# Altium schematic sheet DRV_TOP_MOS.SchDoc
size A2; SheetNumber: 3; SheetTotal: 4
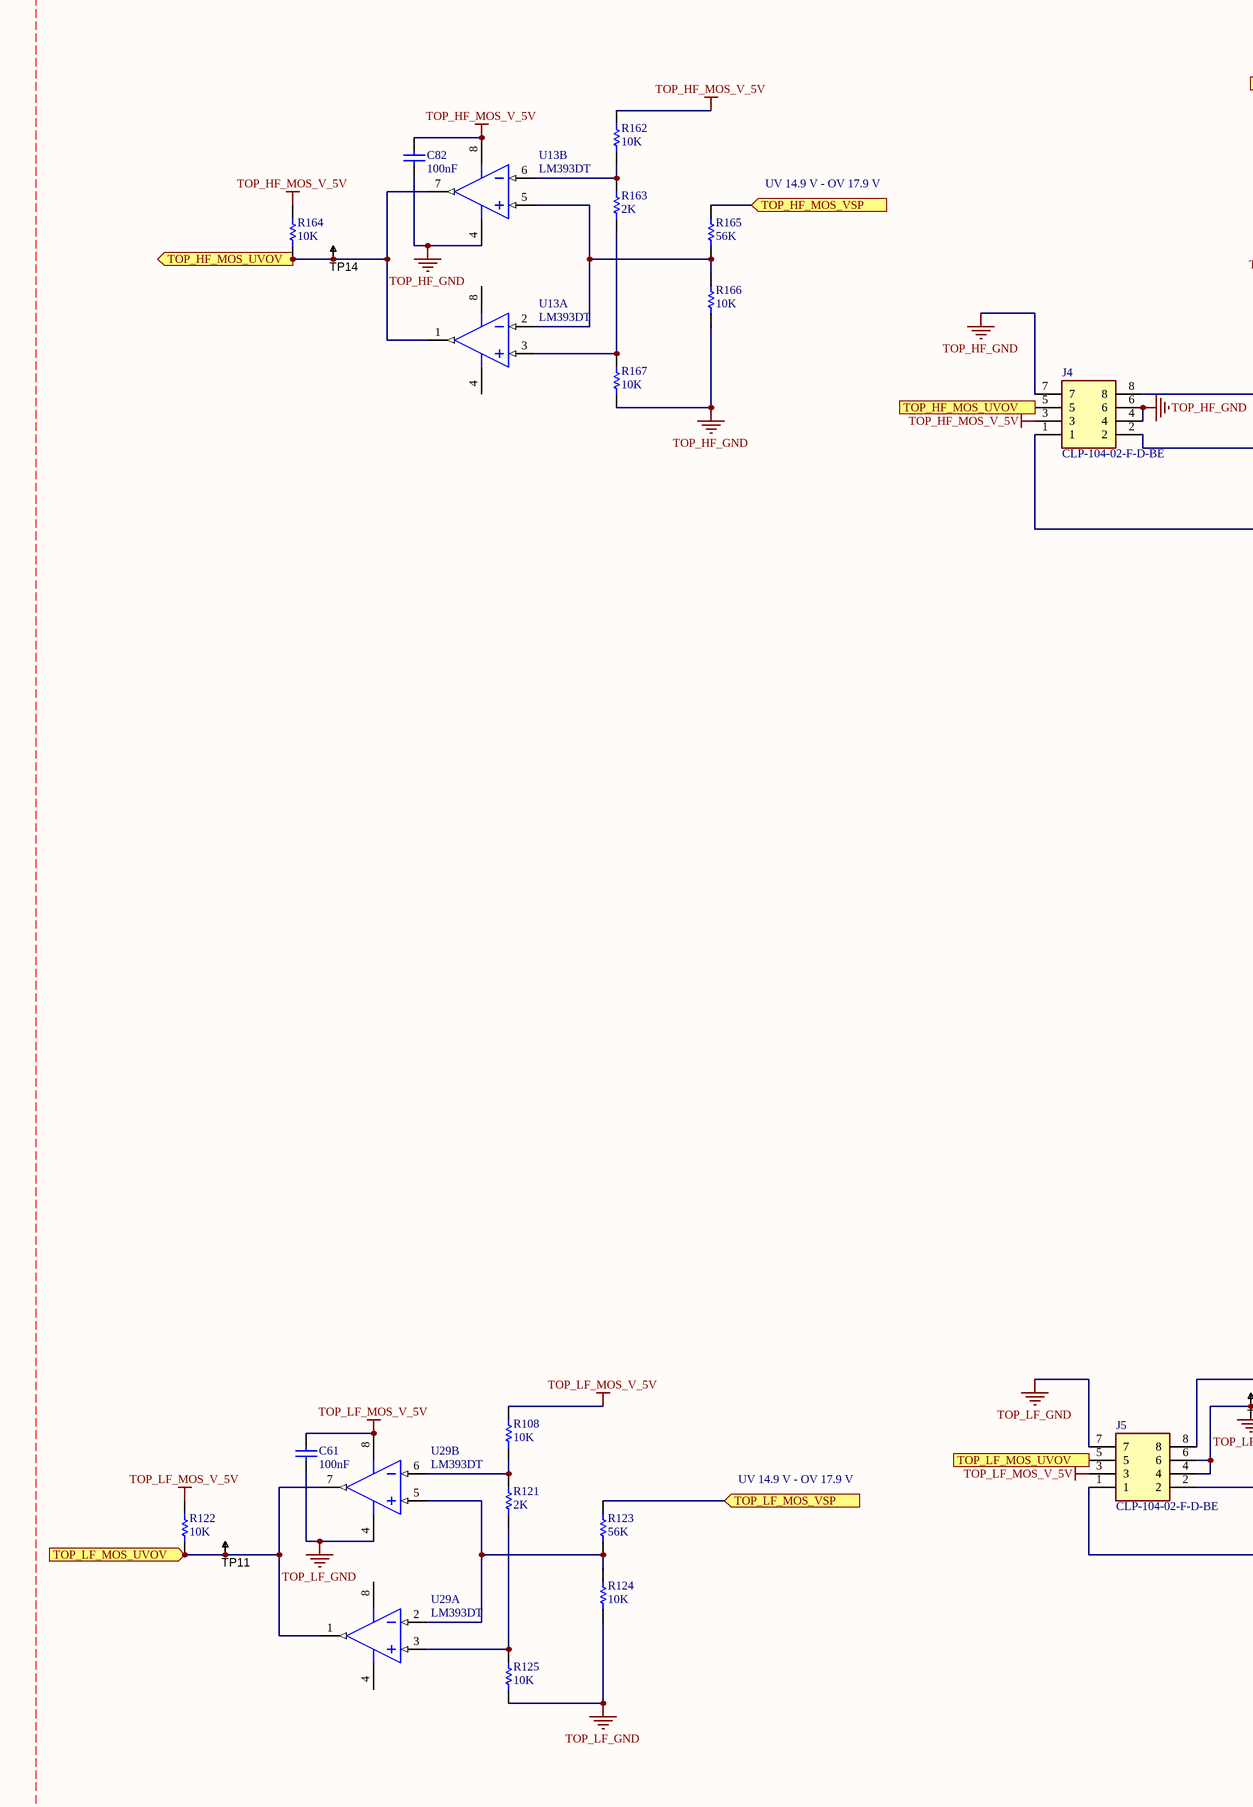
[diagram p0: DRV_TOP_MOS.SchDoc, left]
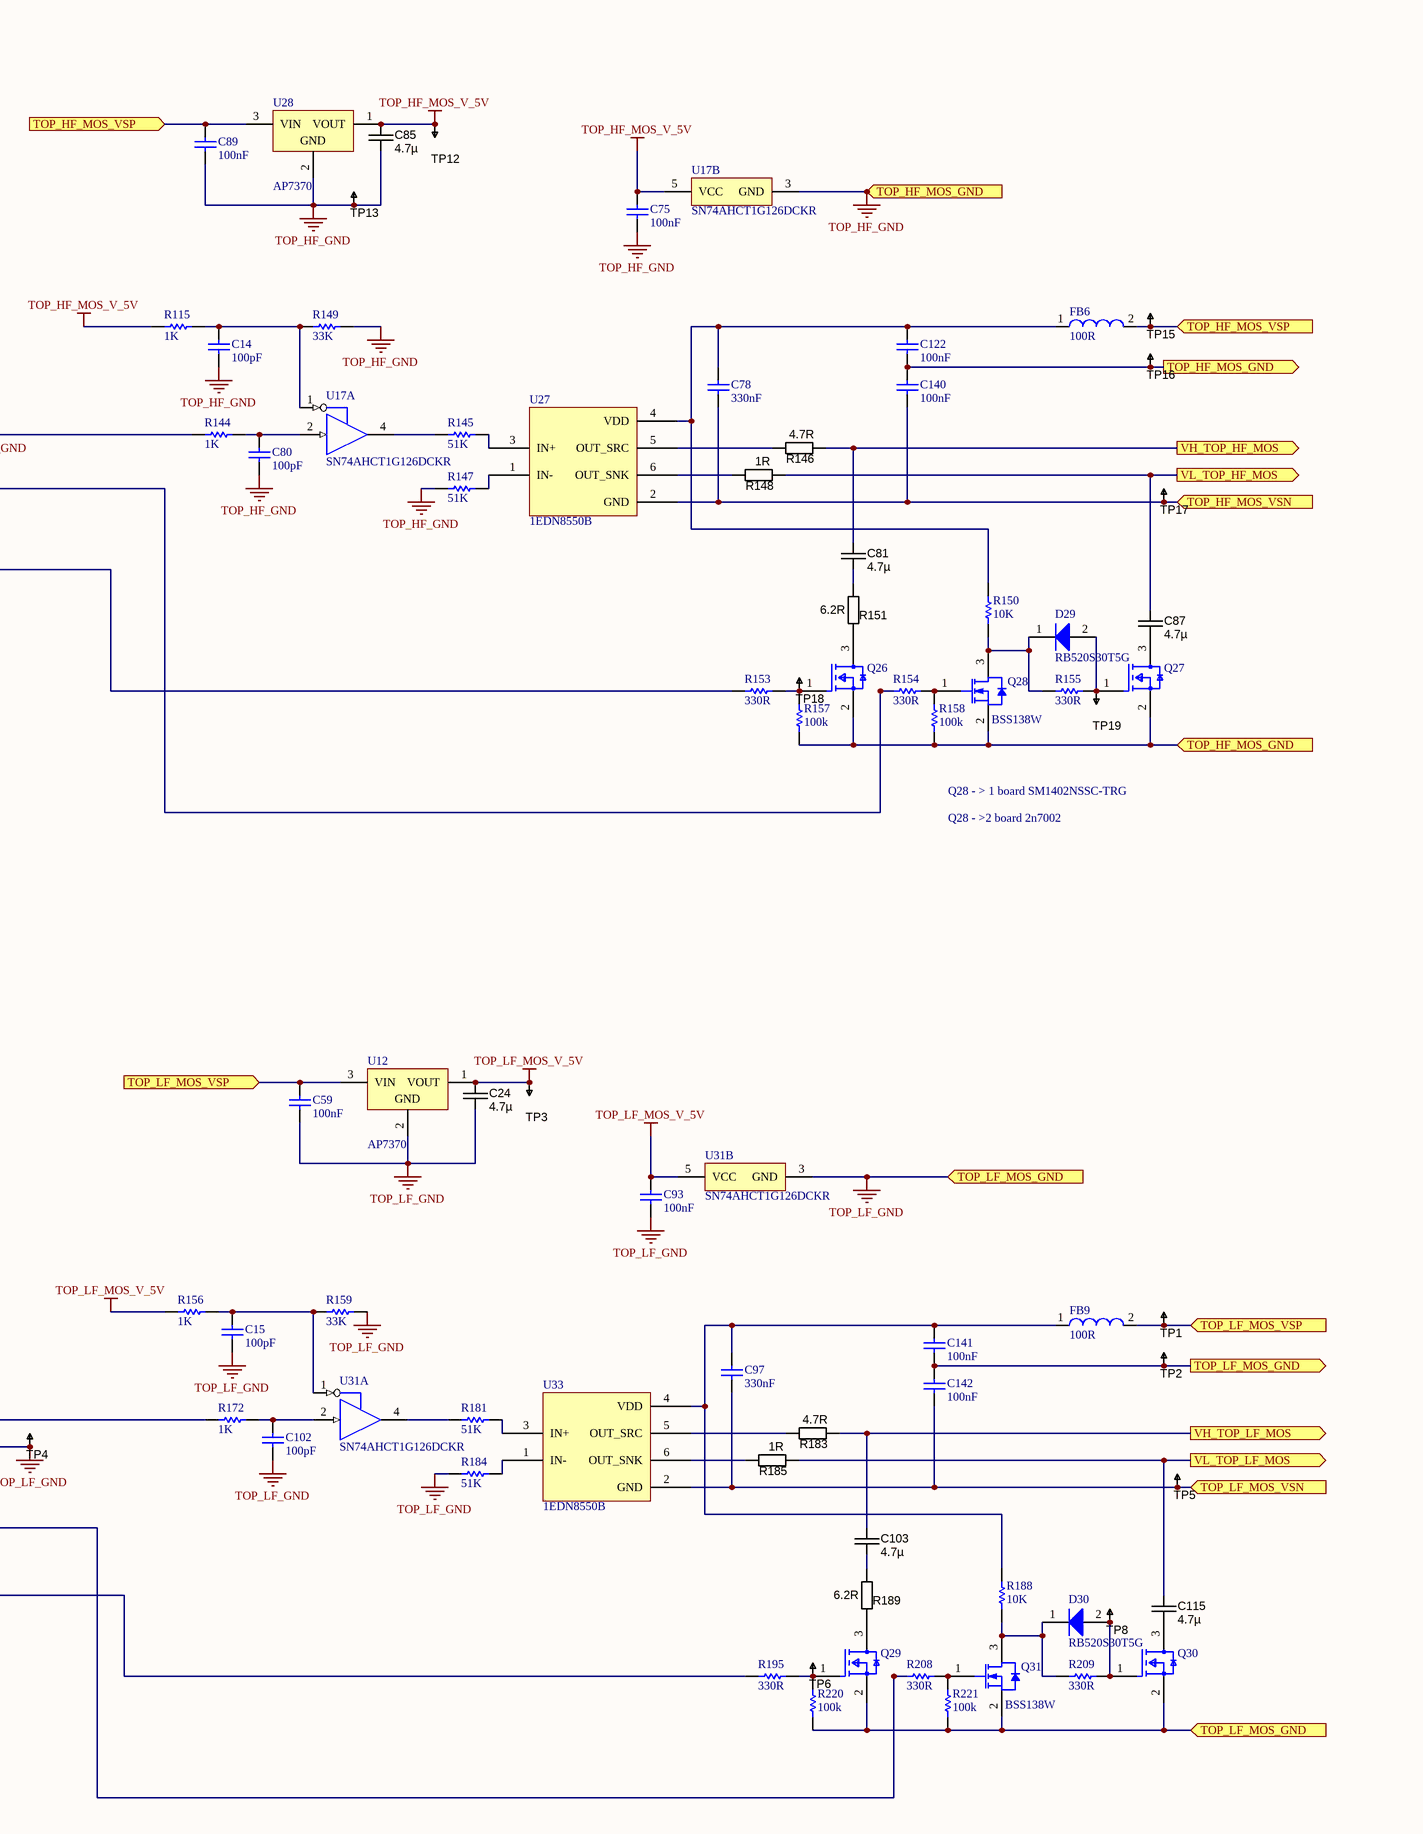
[diagram p1: DRV_TOP_MOS.SchDoc, right]

## Parts
C14  100pF  [CAPC1005X55X25NL05T10]
C15  100pF  [CAPC1005X55X25NL05T10]
C24  value 4.7µ  [CAPC2012X135N]  (hidden comment: 4.7uF)
C59  100nF  [CAPC1608X90X35NL10T15]
C61  100nF  [CAPC1608X90X35NL10T15]
C75  100nF  [CAPC1608X90X35NL10T15]
C78  330nF  [CAPC2013X135X45NL10T25]
C80  100pF  [CAPC1005X55X25NL05T10]
C81  value 4.7µ  [CAPC2012X135N]  (hidden comment: 4.7uF)
C82  100nF  [CAPC1608X90X35NL10T15]
C85  value 4.7µ  [CAPC2012X135N]  (hidden comment: 4.7uF)
C87  value 4.7µ  [CAPC2012X135N]  (hidden comment: 4.7uF)
C89  100nF  [CAPC1608X90X35NL10T15]
C93  100nF  [CAPC1608X90X35NL10T15]
C97  330nF  [CAPC2013X135X45NL10T25]
C102  100pF  [CAPC1005X55X25NL05T10]
C103  value 4.7µ  [CAPC2012X135N]  (hidden comment: 4.7uF)
C115  value 4.7µ  [CAPC2012X135N]  (hidden comment: 4.7uF)
C122  100nF  [CAPC1608X90X35NL10T15]
C140  100nF  [CAPC1608X90X35NL10T15]
C141  100nF  [CAPC1608X90X35NL10T15]
C142  100nF  [CAPC1608X90X35NL10T15]
D29  RB520S30T5G  [ONSC-SOD-523-2-502-01_V]
D30  RB520S30T5G  [ONSC-SOD-523-2-502-01_V]
FB6  100R  [SMD-0603]
FB9  100R  [SMD-0603]
J4  CLP-104-02-F-D-BE  [CLP-104-02-XXX-D-BE]
J5  CLP-104-02-F-D-BE  [CLP-104-02-XXX-D-BE]
Q26  DMN3067LW-7  [FP-SOT323-IPC_C]  (value not drawn)
Q27  DMN3067LW-7  [FP-SOT323-IPC_C]  (value not drawn)
Q28  BSS138W  [NXP-SOT323_M]
Q29  DMN3067LW-7  [FP-SOT323-IPC_C]  (value not drawn)
Q30  DMN3067LW-7  [FP-SOT323-IPC_C]  (value not drawn)
Q31  BSS138W  [NXP-SOT323_M]
R108  10K  [RESC1609X55X30NL15T15]
R115  1K  [RESC1005X40X25NL05T10]
R121  2K  [RESC1609X55X30NL15T15]
R122  10K  [RESC1609X55X30NL15T15]
R123  56K  [RESC1609X55X30NL15T15]
R124  10K  [RESC1609X55X30NL15T15]
R125  10K  [RESC1609X55X30NL15T15]
R144  1K  [RESC1005X40X25NL05T10]
R145  51K  [RESC1005X40X25ML05T05]
R146  4.7R  [RESC2012X70N]
R147  51K  [RESC1005X40X25ML05T05]
R148  1R  [RESC2012X70N]
R149  33K  [RESC1005X40X25ML05T05]
R150  10K  [RESC1609X55X30NL15T15]
R151  6.2R  [RESC2012X70N]
R153  330R  [RESC1608X55X25NL10T15]
R154  330R  [RESC1608X55X25NL10T15]
R155  330R  [RESC1608X55X25NL10T15]
R156  1K  [RESC1005X40X25NL05T10]
R157  100k  [RESC1608X55X30NL15T15]
R158  100k  [RESC1608X55X30NL15T15]
R159  33K  [RESC1005X40X25ML05T05]
R162  10K  [RESC1609X55X30NL15T15]
R163  2K  [RESC1609X55X30NL15T15]
R164  10K  [RESC1609X55X30NL15T15]
R165  56K  [RESC1609X55X30NL15T15]
R166  10K  [RESC1609X55X30NL15T15]
R167  10K  [RESC1609X55X30NL15T15]
R172  1K  [RESC1005X40X25NL05T10]
R181  51K  [RESC1005X40X25ML05T05]
R183  4.7R  [RESC2012X70N]
R184  51K  [RESC1005X40X25ML05T05]
R185  1R  [RESC2012X70N]
R188  10K  [RESC1609X50X30NL10T20]
R189  6.2R  [RESC2012X70N]
R195  330R  [RESC1608X55X25NL10T15]
R208  330R  [RESC1608X55X25NL10T15]
R209  330R  [RESC1608X55X25LL10T15]
R220  100k  [RESC1608X55X30NL15T15]
R221  100k  [RESC1608X55X30NL15T15]
TP1  TESTPOINT  [TP-R60]  (value not drawn)  (no BOM)
TP2  TESTPOINT  [TP-R60]  (value not drawn)  (no BOM)
TP3  TESTPOINT  [TP-R60]  (value not drawn)  (no BOM)
TP4  TESTPOINT  [TP-R60]  (value not drawn)  (no BOM)
TP5  TESTPOINT  [TP-R60]  (value not drawn)  (no BOM)
TP6  TESTPOINT  [TP-R60]  (value not drawn)  (no BOM)
TP8  TESTPOINT  [TP-R60]  (value not drawn)  (no BOM)
TP11  TESTPOINT  [TP-R60]  (value not drawn)  (no BOM)
TP12  TESTPOINT  [TP-R60]  (value not drawn)  (no BOM)
TP13  TESTPOINT  [TP-R60]  (value not drawn)  (no BOM)
TP14  TESTPOINT  [TP-R60]  (value not drawn)  (no BOM)
TP15  TESTPOINT  [TP-R60]  (value not drawn)  (no BOM)
TP16  TESTPOINT  [TP-R60]  (value not drawn)  (no BOM)
TP17  TESTPOINT  [TP-R60]  (value not drawn)  (no BOM)
TP18  TESTPOINT  [TP-R60]  (value not drawn)  (no BOM)
TP19  TESTPOINT  [TP-R60]  (value not drawn)  (no BOM)
U12  AP7370  [SOT-89_L]
U13  LM393DT  [SOT65P280X110-8N]  (parts A,B of 2)
U17  SN74AHCT1G126DCKR  [DCK0005A_L]  (parts A,B of 2)
U27  1EDN8550B  [SOT23-6]
U28  AP7370  [SOT-89_L]
U29  LM393DT  [SOT65P280X110-8N]  (parts A,B of 2)
U31  SN74AHCT1G126DCKR  [DCK0005A_L]  (parts A,B of 2)
U33  1EDN8550B  [SOT23-6]

## Ports
TOP_HF_MOS_GND (in), TOP_HF_MOS_GND (out), TOP_HF_MOS_UVOV (in), TOP_HF_MOS_UVOV (out), TOP_HF_MOS_VSN (in), TOP_HF_MOS_VSP (in), TOP_LF_MOS_GND (in), TOP_LF_MOS_GND (out), TOP_LF_MOS_UVOV (in), TOP_LF_MOS_VSN (in), TOP_LF_MOS_VSP (in), VH_TOP_HF_MOS (out), VH_TOP_LF_MOS (out), VL_TOP_HF_MOS (out), VL_TOP_LF_MOS (out)

## Nets
TOP_HF_GND: C14.1 C75.1 C80.1 C82.1 C85.2 C89.1 C122.1 C140.2 J4.4 J4.6 J4.7 Q26.2(S) Q27.2(S) Q28.2(S) R147.1 R149.2 R157.1 R158.1 R166.2 R167.2 TP13.1 TP16.1 U13.4(VCC-) U17.3(GND) U28.2(GND) ; port TOP_HF_MOS_GND
TOP_HF_MOS_V_5V: C75.2 C82.2 C85.1 J4.3 R115.1 R162.1 R164.1 TP12.1 U13.8(VCC+) U17.5(VCC) U28.1(VOUT)
TOP_LF_GND: C15.1 C24.2 C59.1 C61.1 C93.1 C102.1 C141.1 C142.2 J5.4 J5.6 J5.7 Q29.2(S) Q30.2(S) Q31.2(S) R124.2 R125.2 R159.2 R184.1 R220.1 R221.1 TP2.1 TP4.1 U12.2(GND) U29.4(VCC-) U31.3(GND) ; port TOP_LF_MOS_GND
TOP_LF_MOS_V_5V: C24.1 C61.2 C93.2 J5.3 R108.1 R122.1 R156.1 TP3.1 U12.1(VOUT) U29.8(VCC+) U31.5(VCC)
TOP_HF_MOS_UVOV: J4.5 R164.2 TP14.1 U13.1(OUT1) U13.7(OUT2) ; port TOP_HF_MOS_UVOV
TOP_HF_MOS_VSN: C78.1 C140.1 TP17.1 U27.2(GND) ; port TOP_HF_MOS_VSN
TOP_HF_MOS_VSP: C89.2 FB6.2 R165.1 TP15.1 U28.3(VIN) ; port TOP_HF_MOS_VSP
TOP_LF_MOS_UVOV: J5.5 R122.2 TP11.1 U29.1(OUT1) U29.7(OUT2) ; port TOP_LF_MOS_UVOV
TOP_LF_MOS_VSN: C97.1 C142.1 TP5.1 U33.2(GND) ; port TOP_LF_MOS_VSN
TOP_LF_MOS_VSP: C59.2 FB9.2 R123.1 TP1.1 U12.3(VIN) ; port TOP_LF_MOS_VSP
VH_TOP_HF_MOS: C81.1 R146.2 ; port VH_TOP_HF_MOS
VH_TOP_LF_MOS: C103.1 R183.2 ; port VH_TOP_LF_MOS
VL_TOP_HF_MOS: C87.1 R148.2 ; port VL_TOP_HF_MOS
VL_TOP_LF_MOS: C115.1 R185.2 ; port VL_TOP_LF_MOS
NetC14_2: C14.2 R115.2 R149.1 U17.1(OE)
NetC15_2: C15.2 R156.2 R159.1 U31.1(OE)
NetC78_2: C78.2 C122.2 FB6.1 R150.1 U27.4(VDD)
NetC80_2: C80.2 R144.2 U17.2(A)
NetC81_2: C81.2 R151.2
NetC87_2: C87.2 Q27.3(D)
NetC97_2: C97.2 C141.2 FB9.1 R188.2 U33.4(VDD)
NetC102_2: C102.2 R172.2 U31.2(A)
NetC103_2: C103.2 R189.2
NetC115_2: C115.2 Q30.3(D)
NetD29_1: D29.1(K) Q28.3(D) R150.2 R155.1
NetD29_2: D29.2(A) Q27.1(G) R155.2 TP19.1
NetD30_1: D30.1(K) Q31.3(D) R188.1 R209.1
NetD30_2: D30.2(A) Q30.1(G) R209.2 TP8.1
NetJ4_1: J4.1 R153.1
NetJ4_2: J4.2 R154.1
NetJ4_8: J4.8 R144.1
NetJ5_1: J5.1 R195.1
NetJ5_2: J5.2 R208.1
NetJ5_8: J5.8 R172.1
NetQ26_1: Q26.1(G) R153.2 R157.2 TP18.1
NetQ26_3: Q26.3(D) R151.1
NetQ28_1: Q28.1(G) R154.2 R158.2
NetQ29_1: Q29.1(G) R195.2 R220.2 TP6.1
NetQ29_3: Q29.3(D) R189.1
NetQ31_1: Q31.1(G) R208.2 R221.2
NetR108_2: R108.2 R121.1 U29.6(IN2-)
NetR121_2: R121.2 R125.1 U29.3(IN1+)
NetR123_2: R123.2 R124.1 U29.2(IN1-) U29.5(IN2+)
NetR145_1: R145.1 U17.4(Y)
NetR145_2: R145.2 U27.3(IN+)
NetR146_1: R146.1 U27.5(OUT_SRC)
NetR147_2: R147.2 U27.1(IN-)
NetR148_1: R148.1 U27.6(OUT_SNK)
NetR162_2: R162.2 R163.1 U13.6(IN2-)
NetR163_2: R163.2 R167.1 U13.3(IN1+)
NetR165_2: R165.2 R166.1 U13.2(IN1-) U13.5(IN2+)
NetR181_1: R181.1 U31.4(Y)
NetR181_2: R181.2 U33.3(IN+)
NetR183_1: R183.1 U33.5(OUT_SRC)
NetR184_2: R184.2 U33.1(IN-)
NetR185_1: R185.1 U33.6(OUT_SNK)

## Layout directives
net class TOP_MOS: TOP_HF_GND, TOP_HF_MOS_V_5V, TOP_LF_GND, TOP_LF_MOS_V_5V

## Notes on the sheet
- UV 14.9 V - OV 17.9 V
- Q28 - > 1 board SM1402NSSC-TRG
- Q28 - >2 board 2n7002

## Library data of the parts
C14 C15 C80 C102 = CMP-2008-04245-1: C0G ±5% 50V 100pF 0402 Multilayer Ceramic Capacitors MLCC - SMD/SMT ROHS; Part Number: GRM1555C1H100JA01D; Manufacturer: Murata; Capacitance: 10pF; Temperature Coefficient: 30ppm/°C; Supplier 1: Digi-Key; Supplier Part Number 1: 490-5921-1-ND; Manufacturer Part Number: GRM1555C1H100JA01D; RoHS: Yes; Category: Ceramic Capacitors; Stock 1: 1896512; Pricing 1: 1=0.10000, 10=0.01900, 50=0.01060, 100=0.00860, 500=0.00616, 1000=0.00484, 2500=0.00440, 5000=0.00405 (USD); Mount: Surface Mount; Case/Package: 0402; Number of Pins: 2; Case Code (Metric): 1005; Case Code (Imperial): 0402; Material: Ceramic; Min Operating Temperature: -55°C; Max Operating Temperature: 125°C; Tolerance: 5%; Dielectric: C0G; Voltage Rating: 50V; Packaging: Tape and Reel; Package Quantity: 10000; Voltage Rating (DC): 50V; Termination: SMD/SMT; Series: GRM; Construction: Flat; Voltage: 50V; Length: 1mm; Width: 0.02inch; Height: 0.5mm; Thickness: 0.022inch; Depth: 0.5mm; Radiation Hardening: No; RoHS Compliant: Yes; REACH SVHC: No SVHC; Lead Free: Lead Free; ComponentLink1URL: https://datasheet.ciiva.com/2989/product-2989280.pdf?src-supplier=Avnet; ComponentLink1Description: https://datasheet.ciiva.com/2989/product-2989280.pdf?src-supplier=Avnet; ComponentLink2URL: https://datasheet.ciiva.com/18184/getdatasheetpartid-307234-18184164.pdf?src-supplier=Verical; ComponentLink2Description: https://datasheet.ciiva.com/18184/getdatasheetpartid-307234-18184164.pdf?src-supplier=Verical; ComponentLink3URL: https://datasheet.ciiva.com/29200/453545-da-01-en-vs-kondensator-0402-29200107.pdf?src-supplier=Conrad; ComponentLink3Description: https://datasheet.ciiva.com/29200/453545-da-01-en-vs-kondensator-0402-29200107.pdf?src-supplier=Conrad; ComponentLink4URL: https://datasheet.ciiva.com/6271/partnumbering-e-01-6271158.pdf?src-supplier=Digi-Key; ComponentLink4Description: https://datasheet.ciiva.com/6271/partnumbering-e-01-6271158.pdf?src-supplier=Digi-Key; ComponentLink5URL: https://datasheet.ciiva.com/48671/product-48671350.pdf?src-supplier=Avnet; ComponentLink5Description: https://datasheet.ciiva.com/48671/product-48671350.pdf?src-supplier=Avnet; ComponentLink6URL: https://datasheet.ciiva.com/6271/partnumbering-e-01-6271159.pdf?src-supplier=Digi-Key; ComponentLink6Description: https://datasheet.ciiva.com/6271/partnumbering-e-01-6271159.pdf?src-supplier=Digi-Key; ComponentLink7URL: https://datasheet.ciiva.com/6271/partnumbering-e-01-6271068.pdf?src-supplier=Digi-Key; ComponentLink7Description: https://datasheet.ciiva.com/6271/partnumbering-e-01-6271068.pdf?src-supplier=Digi-Key; ComponentLink8URL: https://datasheet.ciiva.com/7828/1666664-7828812.pdf?src-supplier=Element14; ComponentLink8Description: https://datasheet.ciiva.com/7828/1666664-7828812.pdf?src-supplier=Element14; JLCPCB Part #: C1546
C24 C81 C85 C87 C103 C115 = CAPC_1u_0805_X7R_16V_10%: X5R 25V ±10% 4.7uF 0805 Multilayer Ceramic Capacitors MLCC - SMD/SMT ROHS; Manufacturer 1: Yageo; Manufacturer Part Number 1: CC0805KKX7R7BB105; Ratings: 16V; X7R; SCDType: spec; Temperature Coefficient: X7R; Package / Case: 0805 (2012 metric); Tolerance: ±10%; Material: ceramic; Supplier 1: Digi-Key; Supplier Part Number 1: 311-1365-6-ND; RoHS 1: RoHS Compliant; ComponentLink1URL: http://www.yageo.com/documents/recent/UPY-GPHC_X7R_6.3V-to-50V_8.pdf; ComponentLink1Description: http://www.yageo.com/documents/recent/UPY-GPHC_X7R_6.3V-to-50V_8.pdf; Supplier 2: Digi-Key; Supplier Part Number 2: 399-1284-6-ND; Manufacturer 2: Kemet; Manufacturer Part Number 2: C0805C105K4RACTU; RoHS 2: RoHS Compliant; ComponentLink2URL: http://www.kemet.com/datasheets&C0805C105K4RACTU; ComponentLink2Description: http://www.kemet.com/datasheets&C0805C105K4RACTU; Supplier 3: Digi-Key; Supplier Part Number 3: 1276-1026-6-ND; Manufacturer 3: Samsung Electro-Mechanics America, Inc; Manufacturer Part Number 3: CL21B105KOFNNNE; RoHS 3: RoHS Compliant; ComponentLink3URL: http://www.samsungsem.com/servlet/FileDownload?type=spec&file=CL21B105KOFNNNE.pdf; ComponentLink3Description: http://www.samsungsem.com/servlet/FileDownload?type=spec&file=CL21B105KOFNNNE.pdf; Supplier 4: Digi-Key; Supplier Part Number 4: 445-1358-6-ND; Manufacturer 4: TDK Corporation; Manufacturer Part Number 4: C2012X7R1C105K125AA; RoHS 4: RoHS Compliant; ComponentLink4URL: http://product.tdk.com/capacitor/mlcc/en/documents/mlcc_commercial_general_en.pdf; ComponentLink4Description: http://product.tdk.com/capacitor/mlcc/en/documents/mlcc_commercial_general_en.pdf; JLCPCB Part #: C1779
C59 C61 C75 C82 C89 C93 C122 C140-C142 = CAP: X7R 100nF ±10% 50V 0603 Multilayer Ceramic Capacitors MLCC - SMD/SMT ROHS; Part Number: GCM188R72A104KA64D; Manufacturer: Murata; Manufacturer Part Number: CC0603KRX7R9BB104; Voltage Rating: 100V; Supplier 1: Arrow Electronics; Supplier Part Number 1: GCM188R72A104KA64D; RoHS: Yes; Category: Ceramic Capacitors; Mount: Surface Mount; Case/Package: 0603; Case Code (Imperial): 0603; Case Code (Metric): 1608; Min Operating Temperature: -55°C; Max Operating Temperature: 125°C; Tolerance: 10%; Packaging: Tape and Reel; Capacitance: 100nF; Dielectric: X7R; Termination: SMD/SMT; Voltage Rating (DC): 100V; Length: 1.6mm; Height: 0.8mm; Depth: 0.8mm; Radiation Hardening: No; ComponentLink1URL: https://datasheet.ciiva.com/17451/product-17451047.pdf?src-supplier=Avnet+Europe; ComponentLink1Description: https://datasheet.ciiva.com/17451/product-17451047.pdf?src-supplier=Avnet+Europe; ComponentLink2URL: https://datasheet.ciiva.com/26889/getdatasheetpartid-387765-26889164.pdf?src-supplier=Verical; ComponentLink2Description: https://datasheet.ciiva.com/26889/getdatasheetpartid-387765-26889164.pdf?src-supplier=Verical; Parameter 1: *; JLCPCB Part #: C14663
C78 C97 = CMP-2100-03644-1: X7R ±10% 50V 330nF 0805 Multilayer Ceramic Capacitors MLCC - SMD/SMT ROHS; Manufacturer: Murata; Manufacturer Part Number: GRM21BR71H104KA01L; Capacitance: 100nF; Insulation Resistance: 10GR; Package Description: 2-Pin Surface Mount Device, Body 2 x 1.25 mm; Manufacturer URL: http://www.murata.com/; Case Code (Imperial): 0805; Voltage: 50V; Datasheet URL: http://psearch.en.murata.com/capacitor/product/GRM21BR71H104KA01%23.pdf; Termination: SMD/SMT; Lead Free: LeadFree; Package Quantity: 1; Mount: SurfaceMount; REACH SVHC: Unknown; Thickness: 0.053inch; Height: 1.25mm; Case/Package: 0805; Voltage Rating: 50V; Dielectric Material: Ceramic; Width: 0.049inch; Case Code (Metric): 2012; Material: Ceramic; Min Operating Temperature: -55degC; RoHSCompliant: true; Datasheet Version: 42675.0; Voltage Rating (DC): 50V; Tolerance: 10%; Dielectric: X7R; Package Reference: 0805; Depth: 1.25mm; Length: 2mm; Max Operating Temperature: 125degC; Packaging: TapeandReel; Number of Pins: 2; Radiation Hardening: No; Supplier 1: Farnell; Supplier Part Number 1: 2408531; RoHS: Yes; Category: Ceramic Capacitors; Stock 1: 576000; ComponentLink1URL: https://datasheet.ciiva.com/11786/0900766b8003061f-11786305.pdf?src-supplier=RSComponents; ComponentLink1Description: https://datasheet.ciiva.com/11786/0900766b8003061f-11786305.pdf?src-supplier=RSComponents; ComponentLink2URL: https://datasheet.ciiva.com/20173/71-2024-20173169.pdf?src-supplier=Rapid+Electronics; ComponentLink2Description: https://datasheet.ciiva.com/20173/71-2024-20173169.pdf?src-supplier=Rapid+Electronics; ComponentLink3URL: https://datasheet.ciiva.com/29200/453120-da-01-en-vs-kondensator-0805-29200537.pdf?src-supplier=Conrad; ComponentLink3Description: https://datasheet.ciiva.com/29200/453120-da-01-en-vs-kondensator-0805-29200537.pdf?src-supplier=Conrad; ComponentLink4URL: https://datasheet.ciiva.com/132/partnumbering-e-01-132209.pdf?src-supplier=Digi-Key; ComponentLink4Description: https://datasheet.ciiva.com/132/partnumbering-e-01-132209.pdf?src-supplier=Digi-Key; ComponentLink5URL: https://datasheet.ciiva.com/132/partnumbering-e-01-132210.pdf?src-supplier=Digi-Key; ComponentLink5Description: https://datasheet.ciiva.com/132/partnumbering-e-01-132210.pdf?src-supplier=Digi-Key; ComponentLink6URL: https://datasheet.ciiva.com/132/partnumbering-e-01-132211.pdf?src-supplier=Digi-Key; ComponentLink6Description: https://datasheet.ciiva.com/132/partnumbering-e-01-132211.pdf?src-supplier=Digi-Key; ComponentLink7URL: https://datasheet.ciiva.com/7937/1794405-7937708.pdf?src-supplier=Element14; ComponentLink7Description: https://datasheet.ciiva.com/7937/1794405-7937708.pdf?src-supplier=Element14; ComponentLink8URL: https://datasheet.ciiva.com/7937/1794405-7937709.pdf?src-supplier=Element14; ComponentLink8Description: https://datasheet.ciiva.com/7937/1794405-7937709.pdf?src-supplier=Element14; ComponentLink9URL: https://datasheet.ciiva.com/28534/1769893-28534317.pdf?src-supplier=Element14; ComponentLink9Description: https://datasheet.ciiva.com/28534/1769893-28534317.pdf?src-supplier=Element14; ComponentLink10URL: https://datasheet.ciiva.com/7937/4360-7937710.pdf?src-supplier=Element14; ComponentLink10Description: https://datasheet.ciiva.com/7937/4360-7937710.pdf?src-supplier=Element14; JLCPCB Part #: C1740
D29 D30 = CMP-1055-00481-1: Schottky Barrier Diode, 2-Pin SOD-523, Pb-Free, Tape and Reel; Manufacturer: On Semiconductor; Configuration: Single; Mounting Technology: Surface Mount; ComponentLink1URL: http://www.onsemi.com/; ComponentLink3Description: Package Specification; Packing: Tape and Reel; ComponentLink2Description: Datasheet; PackageVersion: Rev. E, 09/2010; PackageReference: SOD-523-2-502-01; ComponentLink2URL: http://www.onsemi.cn/pub_link/Collateral/RB520S30T1-D.PDF; ComponentLink1Description: Manufacturer URL; DatasheetVersion: Rev. 10; RoHS: TRUE; ComponentLink3URL: http://www.onsemi.com/pub_link/Collateral/502-01.PDF; PackageDescription: 2-Pin SOD, Body 1.2 x 0.8 mm; PartNumber: RB520S30T5G
FB6 FB9 = CMP-0220-00115-1: SMD EMI Suppression Ferrite Bead WE-CBF, Z = 1500 Ohm; DatasheetVersion: Dec-2005; ComponentLink1URL: http://www.we-online.com; PackageVersion: 2009; PackageDescription: Chip Inductor, 2-Leads, Body 1.6 x 0.8 mm; ComponentLink2URL: http://www.we-online.de/katalog/media/pdf/742792691.pdf; ComponentLink1Description: Manufacturer Link; ComponentLink2Description: Datasheet; Impedance: 1500 Ohm; PackageReference: SMD-0603
J4 J5 = CLP-104-02-F-D-BE: Connector; Manufacturer_Name: SAMTEC; Datasheet Link: http://suddendocs.samtec.com/prints/erm8-xxx-xx.x-xxx-dv-xxxx-xx-mkt.pdf; Manufacturer_Part_Number: CLP-104-02-F-D-BE; Mouser Part Number: 200-CLP10402FDBE; Mouser Price/Stock: https://www.mouser.co.uk/ProductDetail/Samtec/CLP-104-02-F-D-BE?qs=0lQeLiL1qybJIh6Z%2F3PMbA%3D%3D; Arrow Part Number: CLP-104-02-F-D-BE; Arrow Price/Stock: https://www.arrow.com/en/products/clp-104-02-f-d-be/samtec
Q26 Q27 Q29 Q30 = CMP-2000-05568-2: MOSFET N-CH 60V 115MA SOT323; Element Configuration: Single; Nominal Vgs: 2V; Drain to Source Breakdown Voltage: 70V; Drain to Source Resistance: 2.6R; Input Capacitance: 50pF; On-State Resistance: 7.5R; Number of Channels: 1; Power Dissipation: 200mW; Turn-Off Delay Time: 11ns; Turn-On Delay Time: 7ns; Gate to Source Voltage (Vgs): 20V; Dual Supply Voltage: 60V; Contact Plating: Tin; Min Operating Temperature: -55°C; Radiation Hardening: No; Drain to Source Voltage (Vdss): 60V; Height: 1mm; Max Operating Temperature: 150°C; Voltage Rating (DC): 60V; Case/Package: SOT-323; Weight: 0.000212oz; Mount: Surface Mount; Length: 2.2mm; Lead Free: Lead Free; Threshold Voltage: 2V; Packaging: Tape and Reel; Max Power Dissipation: 200mW; Package Quantity: 1; Continuous Drain Current (ID): 115mA; Number of Pins: 3; Width: 1.35mm; Current Rating: 115mA; Rds On Max: 7.5R; REACH SVHC: No SVHC; Termination: SMD/SMT; Number of Elements: 1
Q28 Q31 = CMP-1259-00109-1: N-Channel Trench MOSFET, 60 V, 0.32 A, -55 to 150 degC, 3-Pin SOT323, Tape and Reel; PartNumber: BSS138PW,115; Manufacturer: NXP Semiconductors; IDM [max] (A): 1.2; ID [max] (A): 0.32; Automotive Qualified: Y; Channel Type: N; VDS [max] (V): 60; Packing: Tape & Reel; DatasheetVersion: Rev. 1; ComponentLink2URL: http://www.nxp.com/documents/data_sheet/BSS138PW.pdf; ComponentLink3Description: Package Specification; PackageReference: SOT323; PackageDescription: 3-Pin Small Outline Transistor Package, Body 2 x 1.25 mm, Pitch 0.65 mm; Code_JEITA: SC-70; ComponentLink3URL: http://www.nxp.com/documents/outline_drawing/sot323_po.pdf; ComponentLink1URL: http://www.nxp.com/; ComponentLink2Description: Datasheet; PackageVersion: 06-03-16, 03/2006; Mounting Technology: Surface Mount; ComponentLink1Description: Manufacturer URL; VGSth [typ] (V): 1.2
R108 R122 R124 R125 R162 R164 R166 R167 = RES-2: ±1% ±100ppm/℃ 10kΩ 0.1W 0603 Chip Resistor - Surface Mount ROHS; Manufacturer: Panasonic; Voltage Rating: 75V; Case\/Package: 0603; Power Rating: 100mW; Resistance: 10KOhm; Temperature Coefficient: 100ppm\/degreesC; Number of Pins: 2; Package Reference: 603; Depth: 0.8mm; Mount: SurfaceMount; Package Description: 2-Pin Surface Mount Device, Body 1.6 x 0.85 mm; Datasheet Version: 02/2017; Length: 1.6mm; Lead Free: LeadFree; Height: 0.45mm; Number of Terminations: 2; Max Power Dissipation: 100mW; Min Operating Temperature: -55degC; Datasheet URL: https://industrial.panasonic.com/cdbs/www-data/pdf/RDA0000/AOA0000C304.pdf; Termination: SMD/SMT; Case Code (Metric): 1608; Case Code (Imperial): 0603; Tolerance: 1%; Max Operating Temperature: 155degC; RoHSCompliant: true; Voltage Rating (DC): 75V; Radiation Hardening: No; Packaging: TapeandReel; Composition: ThickFilm; Mounting Technology: SurfaceMount; Manufacturer URL: http://www.panasonic.com/; Width: 0.031inch; REACH SVHC: NoSVHC; Contact Plating: Tin; Military Standard: Not; Package Quantity: 1; JLCPCB Part #: C25804
R115 R144 R156 R172 = CMP-2002-07472-1: ±1% 1/16W ±100ppm/℃ 1kΩ 0402 Chip Resistor - Surface Mount ROHS; Part Number: RC0402FR-071KL; Manufacturer: Yageo / Phycomp; Resistance: 1kR; Power Rating: 62.5mW; Voltage Rating: 50V; Temperature Coefficient: 100ppm/°C; Max Power Dissipation: 63mW; Supplier 1: Digi-Key; Supplier Part Number 1: 311-1.00KLRCT-ND; Manufacturer Part Number: RC0402FR-071KL; RoHS: Yes; Category: Chip SMD Resistors; Stock 1: 21620273; Pricing 1: 1=0.10000, 10=0.01600, 100=0.00660, 1000=0.00299, 2500=0.00259, 5000=0.00214 (USD); Case/Package: 0402; Number of Pins: 2; Case Code (Imperial): 0402; Case Code (Metric): 1005; Size Code: 0402; Min Operating Temperature: -55°C; Max Operating Temperature: 155°C; Packaging: Tape and Reel; Termination: SMD/SMT; Tolerance: 1%; Series: RC; Resistor Type: Thick Film; Number of Terminations: 2; Resistance Tolerance: 1%; Construction: Rectangular; Features: Moisture Resistant; Voltage Rating (DC): 50V; Technology: THICK FILM; Length: 1mm; Width: 0.5mm; Height: 0.32mm; Depth: 0.5mm; REACH SVHC: Unknown; Military Standard: Not; RoHS Compliant: Yes; Lead Free: Lead Free; ComponentLink1URL: https://datasheet.ciiva.com/11819/0900766b80c66297-11819477.pdf?src-supplier=RSComponents; ComponentLink1Description: https://datasheet.ciiva.com/11819/0900766b80c66297-11819477.pdf?src-supplier=RSComponents; ComponentLink2URL: https://datasheet.ciiva.com/12666/pyu-rc0402-51-rohs-l-6-r-12666741.pdf?src-supplier=Mouser; ComponentLink2Description: https://datasheet.ciiva.com/12666/pyu-rc0402-51-rohs-l-6-r-12666741.pdf?src-supplier=Mouser; ComponentLink3URL: https://datasheet.ciiva.com/17063/pyu-rc0402-51-rohs-l-6-r-17063193.pdf?src-supplier=Future+Electronics; ComponentLink3Description: https://datasheet.ciiva.com/17063/pyu-rc0402-51-rohs-l-6-r-17063193.pdf?src-supplier=Future+Electronics; ComponentLink4URL: https://datasheet.ciiva.com/22747/1018594-22747513.pdf?src-supplier=Element14; ComponentLink4Description: https://datasheet.ciiva.com/22747/1018594-22747513.pdf?src-supplier=Element14; ComponentLink5URL: https://datasheet.ciiva.com/7849/1018594-7849869.pdf?src-supplier=Element14; ComponentLink5Description: https://datasheet.ciiva.com/7849/1018594-7849869.pdf?src-supplier=Element14; ComponentLink6URL: https://datasheet.ciiva.com/7983/1018594-7983502.pdf?src-supplier=Element14; ComponentLink6Description: https://datasheet.ciiva.com/7983/1018594-7983502.pdf?src-supplier=Element14; ComponentLink7URL: https://datasheet.ciiva.com/7849/1018594-7849871.pdf?src-supplier=Element14; ComponentLink7Description: https://datasheet.ciiva.com/7849/1018594-7849871.pdf?src-supplier=Element14; JLCPCB Part #: C11702
R121 R163 = RES-2: ±1% 2kΩ ±100ppm/℃ 0.1W 0603 Chip Resistor - Surface Mount ROHS; Manufacturer: Panasonic; Voltage Rating: 75V; Case\/Package: 0603; Power Rating: 100mW; Resistance: 10KOhm; Temperature Coefficient: 100ppm\/degreesC; Number of Pins: 2; Package Reference: 603; Depth: 0.8mm; Mount: SurfaceMount; Package Description: 2-Pin Surface Mount Device, Body 1.6 x 0.85 mm; Datasheet Version: 02/2017; Length: 1.6mm; Lead Free: LeadFree; Height: 0.45mm; Number of Terminations: 2; Max Power Dissipation: 100mW; Min Operating Temperature: -55degC; Datasheet URL: https://industrial.panasonic.com/cdbs/www-data/pdf/RDA0000/AOA0000C304.pdf; Termination: SMD/SMT; Case Code (Metric): 1608; Case Code (Imperial): 0603; Tolerance: 1%; Max Operating Temperature: 155degC; RoHSCompliant: true; Voltage Rating (DC): 75V; Radiation Hardening: No; Packaging: TapeandReel; Composition: ThickFilm; Mounting Technology: SurfaceMount; Manufacturer URL: http://www.panasonic.com/; Width: 0.031inch; REACH SVHC: NoSVHC; Contact Plating: Tin; Military Standard: Not; Package Quantity: 1; JLCPCB Part #: C22975
R123 R165 = RES-2: ±1% ±100ppm/℃ 56kΩ 0.1W 0603 Chip Resistor - Surface Mount ROHS; Manufacturer: Panasonic; Voltage Rating: 75V; Case\/Package: 0603; Power Rating: 100mW; Resistance: 10KOhm; Temperature Coefficient: 100ppm\/degreesC; Number of Pins: 2; Package Reference: 603; Depth: 0.8mm; Mount: SurfaceMount; Package Description: 2-Pin Surface Mount Device, Body 1.6 x 0.85 mm; Datasheet Version: 02/2017; Length: 1.6mm; Lead Free: LeadFree; Height: 0.45mm; Number of Terminations: 2; Max Power Dissipation: 100mW; Min Operating Temperature: -55degC; Datasheet URL: https://industrial.panasonic.com/cdbs/www-data/pdf/RDA0000/AOA0000C304.pdf; Termination: SMD/SMT; Case Code (Metric): 1608; Case Code (Imperial): 0603; Tolerance: 1%; Max Operating Temperature: 155degC; RoHSCompliant: true; Voltage Rating (DC): 75V; Radiation Hardening: No; Packaging: TapeandReel; Composition: ThickFilm; Mounting Technology: SurfaceMount; Manufacturer URL: http://www.panasonic.com/; Width: 0.031inch; REACH SVHC: NoSVHC; Contact Plating: Tin; Military Standard: Not; Package Quantity: 1; JLCPCB Part #: C23206
R145 R147 R181 R184 = CMP-2002-01144-1: S, THICK FILM, 33K, 100mW, 1%, 0402, FULL REEL; Product Range:PANASONIC - ERJ Series; Resistance:33kohm; Power Rating:100mW; Resistance Tolerance:± 1%; Resistor Case Style:0402 ^1005 Metric]; Resistor Element Type:Thick Film; Part Number: ERJ2RKF3302X; Manufacturer Part Number: ERJ-2RKF3302X; Resistance: 33kR; Voltage Rating: 50V; Temperature Coefficient: 100ppm/°C; Manufacturer: Panasonic; Supplier 1: Digi-Key; Supplier Part Number 1: P33.0KLCT-ND; RoHS: Yes; Category: Chip SMD Resistors; Stock 1: 8872; Pricing 1: 1=0.10000, 10=0.02500, 100=0.01020, 1000=0.00457, 2500=0.00397, 5000=0.00328 (USD); Mount: Surface Mount; Case/Package: 0402; Number of Pins: 2; Case Code (Metric): 1005; Case Code (Imperial): 0402; Contact Plating: Tin; Min Operating Temperature: -55°C; Max Operating Temperature: 155°C; Packaging: Tape and Reel; Tolerance: 1%; Power Rating: 100mW; Termination: SMD/SMT; Resistor Type: Thick Film; Max Power Dissipation: 100mW; Number of Terminations: 2; Package Quantity: 1; Voltage Rating (DC): 50V; Features: Automotive AEC-Q200; Length: 1mm; Width: 0.02inch; Height: 0.35mm; Depth: 0.5mm; Radiation Hardening: No; Military Standard: Not; Lead Free: Lead Free; REACH SVHC: No SVHC; ComponentLink1URL: https://datasheet.ciiva.com/11821/0900766b80f80784-11821294.pdf?src-supplier=RSComponents; ComponentLink1Description: https://datasheet.ciiva.com/11821/0900766b80f80784-11821294.pdf?src-supplier=RSComponents; ComponentLink2URL: https://datasheet.ciiva.com/16784/70260748-16784773.pdf?src-supplier=Allied+Electronics; ComponentLink2Description: https://datasheet.ciiva.com/16784/70260748-16784773.pdf?src-supplier=Allied+Electronics; ComponentLink3URL: https://datasheet.ciiva.com/22673/1678782-22673685.pdf?src-supplier=Element14; ComponentLink3Description: https://datasheet.ciiva.com/22673/1678782-22673685.pdf?src-supplier=Element14; ComponentLink4URL: https://datasheet.ciiva.com/22737/426256-22737285.pdf?src-supplier=Element14; ComponentLink4Description: https://datasheet.ciiva.com/22737/426256-22737285.pdf?src-supplier=Element14; ComponentLink5URL: https://datasheet.ciiva.com/30159/aoa0000ce2-30159014.pdf?src-supplier=Onlinecomponents.com; ComponentLink5Description: https://datasheet.ciiva.com/30159/aoa0000ce2-30159014.pdf?src-supplier=Onlinecomponents.com; ComponentLink6URL: https://datasheet.ciiva.com/9190/aoa0000ce2-9190679.pdf?src-supplier=Avnet; ComponentLink6Description: https://datasheet.ciiva.com/9190/aoa0000ce2-9190679.pdf?src-supplier=Avnet; ComponentLink7URL: https://datasheet.ciiva.com/17210/aoa0000ce2-17210312.pdf?src-supplier=Avnet+Europe; ComponentLink7Description: https://datasheet.ciiva.com/17210/aoa0000ce2-17210312.pdf?src-supplier=Avnet+Europe; ComponentLink8URL: https://datasheet.ciiva.com/7802/aoa0000ce2-7802409.pdf?src-supplier=Element14; ComponentLink8Description: https://datasheet.ciiva.com/7802/aoa0000ce2-7802409.pdf?src-supplier=Element14; ComponentLink9URL: https://datasheet.ciiva.com/46420/1678782-46420317.pdf?src-supplier=Element14; ComponentLink9Description: https://datasheet.ciiva.com/46420/1678782-46420317.pdf?src-supplier=Element14; ComponentLink10URL: https://datasheet.ciiva.com/24024/aoa0000ce2-24024398.pdf?src-supplier=Mouser; ComponentLink10Description: https://datasheet.ciiva.com/24024/aoa0000ce2-24024398.pdf?src-supplier=Mouser; ComponentLink11URL: https://datasheet.ciiva.com/22687/1678782-22687071.pdf?src-supplier=Element14; ComponentLink11Description: https://datasheet.ciiva.com/22687/1678782-22687071.pdf?src-supplier=Element14
R146 R183 = RES_EMPTY_0805: 4.7Ω ±1% ±400ppm/℃ 0.125W 0805 Chip Resistor - Surface Mount ROHS; Value: N/A; Package / Case: 0805 (2012 metric); JLCPCB Part #: C17675
R148 R185 = RES_EMPTY_0805: ±1% 1Ω ±400ppm/℃ 0.125W 0805 Chip Resistor - Surface Mount ROHS; Value: N/A; Package / Case: 0805 (2012 metric); JLCPCB Part #: C25271
R149 R159 = RES: S, THICK FILM, 33K, 100mW, 1%, 0402, FULL REEL; Product Range:PANASONIC - ERJ Series; Resistance:33kohm; Power Rating:100mW; Resistance Tolerance:± 1%; Resistor Case Style:0402 ^1005 Metric]; Resistor Element Type:Thick Film; Part Number: ERJ2RKF3302X; Manufacturer Part Number: ERJ-2RKF3302X; Resistance: 33kR; Voltage Rating: 50V; Temperature Coefficient: 100ppm/°C; Manufacturer: Panasonic; Supplier 1: Digi-Key; Supplier Part Number 1: P33.0KLCT-ND; RoHS: Yes; Category: Chip SMD Resistors; Stock 1: 8872; Pricing 1: 1=0.10000, 10=0.02500, 100=0.01020, 1000=0.00457, 2500=0.00397, 5000=0.00328 (USD); Mount: Surface Mount; Case/Package: 0402; Number of Pins: 2; Case Code (Metric): 1005; Case Code (Imperial): 0402; Contact Plating: Tin; Min Operating Temperature: -55°C; Max Operating Temperature: 155°C; Packaging: Tape and Reel; Tolerance: 1%; Power Rating: 100mW; Termination: SMD/SMT; Resistor Type: Thick Film; Max Power Dissipation: 100mW; Number of Terminations: 2; Package Quantity: 1; Voltage Rating (DC): 50V; Features: Automotive AEC-Q200; Length: 1mm; Width: 0.02inch; Height: 0.35mm; Depth: 0.5mm; Radiation Hardening: No; Military Standard: Not; Lead Free: Lead Free; REACH SVHC: No SVHC; ComponentLink1URL: https://datasheet.ciiva.com/11821/0900766b80f80784-11821294.pdf?src-supplier=RSComponents; ComponentLink1Description: https://datasheet.ciiva.com/11821/0900766b80f80784-11821294.pdf?src-supplier=RSComponents; ComponentLink2URL: https://datasheet.ciiva.com/16784/70260748-16784773.pdf?src-supplier=Allied+Electronics; ComponentLink2Description: https://datasheet.ciiva.com/16784/70260748-16784773.pdf?src-supplier=Allied+Electronics; ComponentLink3URL: https://datasheet.ciiva.com/22673/1678782-22673685.pdf?src-supplier=Element14; ComponentLink3Description: https://datasheet.ciiva.com/22673/1678782-22673685.pdf?src-supplier=Element14; ComponentLink4URL: https://datasheet.ciiva.com/22737/426256-22737285.pdf?src-supplier=Element14; ComponentLink4Description: https://datasheet.ciiva.com/22737/426256-22737285.pdf?src-supplier=Element14; ComponentLink5URL: https://datasheet.ciiva.com/30159/aoa0000ce2-30159014.pdf?src-supplier=Onlinecomponents.com; ComponentLink5Description: https://datasheet.ciiva.com/30159/aoa0000ce2-30159014.pdf?src-supplier=Onlinecomponents.com; ComponentLink6URL: https://datasheet.ciiva.com/9190/aoa0000ce2-9190679.pdf?src-supplier=Avnet; ComponentLink6Description: https://datasheet.ciiva.com/9190/aoa0000ce2-9190679.pdf?src-supplier=Avnet; ComponentLink7URL: https://datasheet.ciiva.com/17210/aoa0000ce2-17210312.pdf?src-supplier=Avnet+Europe; ComponentLink7Description: https://datasheet.ciiva.com/17210/aoa0000ce2-17210312.pdf?src-supplier=Avnet+Europe; ComponentLink8URL: https://datasheet.ciiva.com/7802/aoa0000ce2-7802409.pdf?src-supplier=Element14; ComponentLink8Description: https://datasheet.ciiva.com/7802/aoa0000ce2-7802409.pdf?src-supplier=Element14; ComponentLink9URL: https://datasheet.ciiva.com/46420/1678782-46420317.pdf?src-supplier=Element14; ComponentLink9Description: https://datasheet.ciiva.com/46420/1678782-46420317.pdf?src-supplier=Element14; ComponentLink10URL: https://datasheet.ciiva.com/24024/aoa0000ce2-24024398.pdf?src-supplier=Mouser; ComponentLink10Description: https://datasheet.ciiva.com/24024/aoa0000ce2-24024398.pdf?src-supplier=Mouser; ComponentLink11URL: https://datasheet.ciiva.com/22687/1678782-22687071.pdf?src-supplier=Element14; ComponentLink11Description: https://datasheet.ciiva.com/22687/1678782-22687071.pdf?src-supplier=Element14
R150 = CMP-2000-07452-1: ±1% ±100ppm/℃ 10kΩ 0.1W 0603 Chip Resistor - Surface Mount ROHS; Manufacturer: Panasonic; Voltage Rating: 75V; Case\/Package: 0603; Power Rating: 100mW; Resistance: 10KOhm; Temperature Coefficient: 100ppm\/degreesC; Number of Pins: 2; Package Reference: 603; Depth: 0.8mm; Mount: SurfaceMount; Package Description: 2-Pin Surface Mount Device, Body 1.6 x 0.85 mm; Datasheet Version: 02/2017; Length: 1.6mm; Lead Free: LeadFree; Height: 0.45mm; Number of Terminations: 2; Max Power Dissipation: 100mW; Min Operating Temperature: -55degC; Datasheet URL: https://industrial.panasonic.com/cdbs/www-data/pdf/RDA0000/AOA0000C304.pdf; Termination: SMD/SMT; Case Code (Metric): 1608; Case Code (Imperial): 0603; Tolerance: 1%; Max Operating Temperature: 155degC; RoHSCompliant: true; Voltage Rating (DC): 75V; Radiation Hardening: No; Packaging: TapeandReel; Composition: ThickFilm; Mounting Technology: SurfaceMount; Manufacturer URL: http://www.panasonic.com/; Width: 0.031inch; REACH SVHC: NoSVHC; Contact Plating: Tin; Military Standard: Not; Package Quantity: 1; JLCPCB Part #: C25804
R151 R189 = RES_EMPTY_0805: Resistor, 0805 SMD, Empty footprint; Value: N/A; Package / Case: 0805 (2012 metric)
R153-R155 R195 R208 = CMP-1659-00020-2: ±1% 330Ω ±100ppm/℃ 0.1W 0603 Chip Resistor - Surface Mount ROHS; Tolerance: 10%; ESR: 800 mohm; Voltage Rating (DC): 16 V; Capacitance: 47 uF; Length: 7.3 mm; ComponentLink1URL: http://www.yageo.com/; Packaging: Tape and Reel; Pins: 2; ComponentLink1Description: Manufacturer URL; Case Code (Imperial): 2917; REACH SVHC: No SVHC; Width: 4.3 mm; ComponentLink2Description: Datasheet; Voltage Rating: 16 V; RoHSCompliant: True; Max Operating Temperature: 125degC; ComponentLink2URL: http://www.yageo.com/documents/recent/PYu-RC_Group_51_RoHS_L_04.pdf; Min Operating Temperature: -55degC; Case/Package: 2917; Radiation Hardening: No; DatasheetVersion: Rev. 4, 02/2016; Mount: Surface Mount; PackageReference: 0603; Package Quantity: 500; Case Code (Metric): 7343; PackageDescription: 2-Pin Surface Mount Device, Body 1.6 x 0.8 mm; Height: 3.1 mm; Parameter 1: *; JLCPCB Part #: C23138
R157 R158 R220 R221 = CMP-2000-00182-1: ±1% 100kΩ ±100ppm/℃ 0.1W 0603 Chip Resistor - Surface Mount ROHS; Part Number: ERJ-3EKF1003V; Manufacturer: Panasonic; Manufacturer Part Number: ERJ3EKF1003V; Resistance: 100kR; Power Rating: 100mW; Temperature Coefficient: 100ppm/°C; Voltage Rating: 75V; Supplier 1: Digi-Key; Supplier Part Number 1: P100KHCT-ND; RoHS: Yes; Category: Chip SMD Resistors; Stock 1: 2532776; Pricing 1: 1=0.10000, 10=0.05700, 100=0.02340, 1000=0.01049, 2500=0.00911 (USD); Mount: Surface Mount; Case/Package: 0603; Number of Pins: 2; Weight: 7.1E-05oz; Case Code (Imperial): 0603; Case Code (Metric): 1608; Contact Plating: Tin; Min Operating Temperature: -55°C; Max Operating Temperature: 155°C; Tolerance: 1%; Packaging: Tape and Reel; Composition: Thick Film; Termination: SMD/SMT; Package Quantity: 5000; Number of Terminations: 2; Max Power Dissipation: 100mW; Military Standard: Not; Voltage Rating (DC): 75V; Features: Automotive AEC-Q200; Length: 1.6mm; Height: 0.022inch; Width: 0.8mm; Depth: 0.8mm; Radiation Hardening: No; Lead Free: Lead Free; REACH SVHC: No SVHC; ComponentLink1URL: https://datasheet.ciiva.com/34303/1987476-34303566.pdf?src-supplier=Jameco; ComponentLink1Description: https://datasheet.ciiva.com/34303/1987476-34303566.pdf?src-supplier=Jameco; ComponentLink2URL: https://datasheet.ciiva.com/30133/aoa0000ce2-30133845.pdf?src-supplier=Onlinecomponents.com; ComponentLink2Description: https://datasheet.ciiva.com/30133/aoa0000ce2-30133845.pdf?src-supplier=Onlinecomponents.com; ComponentLink3URL: https://datasheet.ciiva.com/15158/getdatasheetpartid-247527-15158907.pdf?src-supplier=Verical; ComponentLink3Description: https://datasheet.ciiva.com/15158/getdatasheetpartid-247527-15158907.pdf?src-supplier=Verical; ComponentLink4URL: https://datasheet.ciiva.com/16770/70260748-16770253.pdf?src-supplier=Allied+Electronics; ComponentLink4Description: https://datasheet.ciiva.com/16770/70260748-16770253.pdf?src-supplier=Allied+Electronics; ComponentLink5URL: https://datasheet.ciiva.com/16740/aoa0000ce2-16740662.pdf?src-supplier=Future+Electronics; ComponentLink5Description: https://datasheet.ciiva.com/16740/aoa0000ce2-16740662.pdf?src-supplier=Future+Electronics; Supplier 2: Newark; Supplier Part Number 2: 85Y8503; Stock 2: 3015148; Pricing 2: 5000=0.02500, 10000=0.02400, 20000=0.01800 (USD); Size Code: 0603; Resistor Type: Thick Film; Series: ERJ; Resistance Tolerance: 1%; Construction: Rectangular; RoHS Compliant: Yes; JLCPCB Part #: C25803
R188 = RES-2: ±1% ±100ppm/℃ 10kΩ 0.1W 0603 Chip Resistor - Surface Mount ROHS; Manufacturer: Vishay Semiconductor; Manufacturer Part Number: CRCW060310K0FKEA; Voltage Rating: 75 V; Resistance: 10kR; Power Rating: 100mW; Temperature Coefficient: 100ppm/°C; Voltage Rating (DC): 75V; Max Operating Temperature: 155 degC; PackageDescription: 2-Pin Surface Mount Device, Body 1.575 x 0.85 mm; ComponentLink1Description: Manufacturer URL; RoHSCompliant: true; PackageReference: 0603; REACH SVHC: Unknown; Length: 1.55 mm; DatasheetVersion: 06/2012; Packaging: Tape and Reel; Min Operating Temperature: -55 degC; Mounting Technology: Surface Mount; ComponentLink2URL: https://datasheet.ciiva.com/11809/0900766b80d98afc-11809037.pdf; Height: 0.45 mm; ComponentLink2Description: Datasheet; Package Quantity: 5000; ComponentLink1URL: http://www.vishay.com/; Supplier 1: Future Electronics; Supplier Part Number 1: 8926099; RoHS: Yes; Category: Chip SMD Resistors; Stock 1: 2665000; Pricing 1: 5000=0.00790 (USD); Case/Package: 0603; Number of Pins: 2; Case Code (Metric): 1608; Case Code (Imperial): 0603; Contact Plating: Tin,Lead; Weight: 7.1E-05oz; Size Code: 0603; Tolerance: 1%; Max Power Dissipation: 100mW; Series: CRCW; Resistance Tolerance: 1%; Termination: SMD/SMT; Resistor Type: Thick Film; Number of Terminations: 2; Construction: Rectangular; Features: Automotive AEC-Q200; Technology: THICK FILM; Width: 0.033inch; Depth: 0.85mm; Radiation Hardening: No; Lead Free: Lead Free; RoHS Compliant: Yes; Military Standard: Not; ComponentLink3URL: https://datasheet.ciiva.com/11809/0900766b80d98afc-11809037.pdf?src-supplier=RSComponents; ComponentLink3Description: https://datasheet.ciiva.com/11809/0900766b80d98afc-11809037.pdf?src-supplier=RSComponents; ComponentLink4URL: https://datasheet.ciiva.com/16886/dcrcw-16886037.pdf?src-supplier=Avnet+Europe; ComponentLink4Description: https://datasheet.ciiva.com/16886/dcrcw-16886037.pdf?src-supplier=Avnet+Europe; ComponentLink5URL: https://datasheet.ciiva.com/26821/getdatasheetpartid-86831-26821109.pdf?src-supplier=Verical; ComponentLink5Description: https://datasheet.ciiva.com/26821/getdatasheetpartid-86831-26821109.pdf?src-supplier=Verical; ComponentLink6URL: https://datasheet.ciiva.com/16754/70201119-16754710.pdf?src-supplier=Allied+Electronics; ComponentLink6Description: https://datasheet.ciiva.com/16754/70201119-16754710.pdf?src-supplier=Allied+Electronics; ComponentLink7URL: https://datasheet.ciiva.com/16719/70201119-16719704.pdf?src-supplier=Allied+Electronics; ComponentLink7Description: https://datasheet.ciiva.com/16719/70201119-16719704.pdf?src-supplier=Allied+Electronics; ComponentLink8URL: https://datasheet.ciiva.com/2465/dcrcwe3-2465513.pdf?src-supplier=Digi-Key; ComponentLink8Description: https://datasheet.ciiva.com/2465/dcrcwe3-2465513.pdf?src-supplier=Digi-Key; ComponentLink9URL: https://datasheet.ciiva.com/5543/dcrcwe3-109170-5543001.pdf?src-supplier=Mouser; ComponentLink9Description: https://datasheet.ciiva.com/5543/dcrcwe3-109170-5543001.pdf?src-supplier=Mouser; ComponentLink10URL: https://datasheet.ciiva.com/2465/dcrcwe3-2465514.pdf?src-supplier=Digi-Key; ComponentLink10Description: https://datasheet.ciiva.com/2465/dcrcwe3-2465514.pdf?src-supplier=Digi-Key; ComponentLink11URL: https://datasheet.ciiva.com/46385/1697337-46385498.pdf?src-supplier=Element14; ComponentLink11Description: https://datasheet.ciiva.com/46385/1697337-46385498.pdf?src-supplier=Element14; ComponentLink12URL: https://datasheet.ciiva.com/2465/dcrcwe3-2465515.pdf?src-supplier=Digi-Key; ComponentLink12Description: https://datasheet.ciiva.com/2465/dcrcwe3-2465515.pdf?src-supplier=Digi-Key; ComponentLink13URL: https://datasheet.ciiva.com/3256/dcrcwe3-3256939.pdf?src-supplier=Avnet; ComponentLink13Description: https://datasheet.ciiva.com/3256/dcrcwe3-3256939.pdf?src-supplier=Avnet; ComponentLink14URL: https://datasheet.ciiva.com/3256/dcrcwe3-3256940.pdf?src-supplier=Avnet; ComponentLink14Description: https://datasheet.ciiva.com/3256/dcrcwe3-3256940.pdf?src-supplier=Avnet; ComponentLink15URL: https://datasheet.ciiva.com/16209/dcrcwe3-16209164.pdf?src-supplier=Future+Electronics; ComponentLink15Description: https://datasheet.ciiva.com/16209/dcrcwe3-16209164.pdf?src-supplier=Future+Electronics; ComponentLink16URL: https://datasheet.ciiva.com/26314/fld-crcw-e3-data-en-26314749.pdf?src-supplier=Distrelec; ComponentLink16Description: https://datasheet.ciiva.com/26314/fld-crcw-e3-data-en-26314749.pdf?src-supplier=Distrelec; JLCPCB Part #: C25804
R209 = CMP-1659-00020-2: Chip Resistor, 330 Ohm, +/- 1%, 0.1 W, -55 to 155 degC, 0603 (1608 Metric), RoHS, Tape and Reel; Tolerance: 10%; ESR: 800 mohm; Voltage Rating (DC): 16 V; Capacitance: 47 uF; Length: 7.3 mm; ComponentLink1URL: http://www.yageo.com/; Packaging: Tape and Reel; Pins: 2; ComponentLink1Description: Manufacturer URL; Case Code (Imperial): 2917; REACH SVHC: No SVHC; Width: 4.3 mm; ComponentLink2Description: Datasheet; Voltage Rating: 16 V; RoHSCompliant: True; Max Operating Temperature: 125degC; ComponentLink2URL: http://www.yageo.com/documents/recent/PYu-RC_Group_51_RoHS_L_04.pdf; Min Operating Temperature: -55degC; Case/Package: 2917; Radiation Hardening: No; DatasheetVersion: Rev. 4, 02/2016; Mount: Surface Mount; PackageReference: 0603; Package Quantity: 500; Case Code (Metric): 7343; PackageDescription: 2-Pin Surface Mount Device, Body 1.6 x 0.8 mm; Height: 3.1 mm
TP1-TP6 TP8 TP11-TP19 = TESTPOINT: SMD test pin
U12 U28 = CMP-0244-00401-1: Ultra Low Drop Voltage Regulators with Inhibit, Low ESR Output Capacitors Compatible, 3.3V, 3-Pin SOT-89, Tape and Reel; ComponentLink1Description: Manufacturer URL; ComponentLink2URL: http://www.st.com/internet/com/TECHNICAL_RESOURCES/TECHNICAL_LITERATURE/DATASHEET/CD00001635.pdf; PackageReference: SOT-89; DatasheetVersion: 14/07/2008; ComponentLink2Description: Datasheet; ComponentLink1URL: http://www.st.com; PackageDescription: 3-Pin SOT-89 Package 1.5 mm Pitch, 4.1 mm Lead Span; PackageVersion: 2011
U13 U29 = STM-LM393-SO8: Low-Power, Dual-Voltage Comparator, 2 to 36 V, 0 to 70 degC, 8-Pin SOIC (SO), RoHS, Tape and Reel; Manufacturer: STMicroelectronics; Voltage - Supply, Single/Dual (±): 2V~36V,±1V~18V; Current - Input Bias (Max): 0.25µA@5V; Number of Elements: 2; Current - Output (Typ): 18mA@5V; Other Names: 497-1593-2; Voltage - Input Offset (Max): 5mV@30V; Output Type: CMOS,DTL,ECL,MOS,Open-Collector,TTL; EDA / CAD Models: DownloadfromAcceleratedDesigns; Other Related Documents: LM393ViewAllSpecificationsLM393ViewAllSpecifications; Online Catalog: Comparators-2elements; Current - Quiescent (Max): 2.5mA; Standard Package: 2,500; Manufacturer URL: http://www.st.com/; Package Description: 8-Pin Small Outline Integrated Circuit, Body 4.9 x 3.9 mm, Pitch 1.27 mm; Packaging: Tape&Reel(TR); Datasheet Version: Rev. 15, 02/2016; Category: IntegratedCircuits(ICs); Operating Temperature: 0°C~70°C; Mounting Type: SurfaceMount; Supplier Device Package: 8-SO; Datasheet URL: http://www.st.com/content/ccc/resource/technical/document/datasheet/group1/b4/cc/cf/13/18/28/44/f5/CD00000465/files/CD00000465.pdf/jcr:content/translations/en.CD00000465.pdf; Family: Linear-Comparators; Mounting Technology: SurfaceMount; Type: GeneralPurpose; Package Reference: SO-8; Package / Case: 8-SOIC(0.154",3.90mmWidth)
U17 U31 = CMP-0859-00258-3: Single Bus Buffer Gate With 3-State Output, DCK0005A, LARGE T&R; Manufacturer: Texas Instruments; Bits(#): 1; 3-State Output: Yes; Input Type: CMOS; VCC(Min)(V): 2; Schmitt Trigger: No; Rating: Catalog; tpd @ Nom Voltage(Max)(ns): 6; Voltage(Nom)(V): 5; Technology Family: AHCT; ICC @ Nom Voltage(Max)(mA): 0.01; Output Drive (IOL/IOH)(Max)(mA): 8/-8; Sub-Family: Non-Inverting Buffer/Driver; VCC(Max)(V): 5.5; F @ Nom Voltage(Max)(Mhz): 75; Logic: True; Generic Part Number: SN74AHCT1G126; Operating Temperature Range(C): -40 to 125; Output Type: CMOS; PackageReference: DCK0005A; DatasheetVersion: SCLS380J
U27 U33 = 1EDN8550B: Single-channel EiceDRIVER™ with true  differential inputs